# Altium project Bachelor_MCU_Prototype_v1.0.PrjPcb
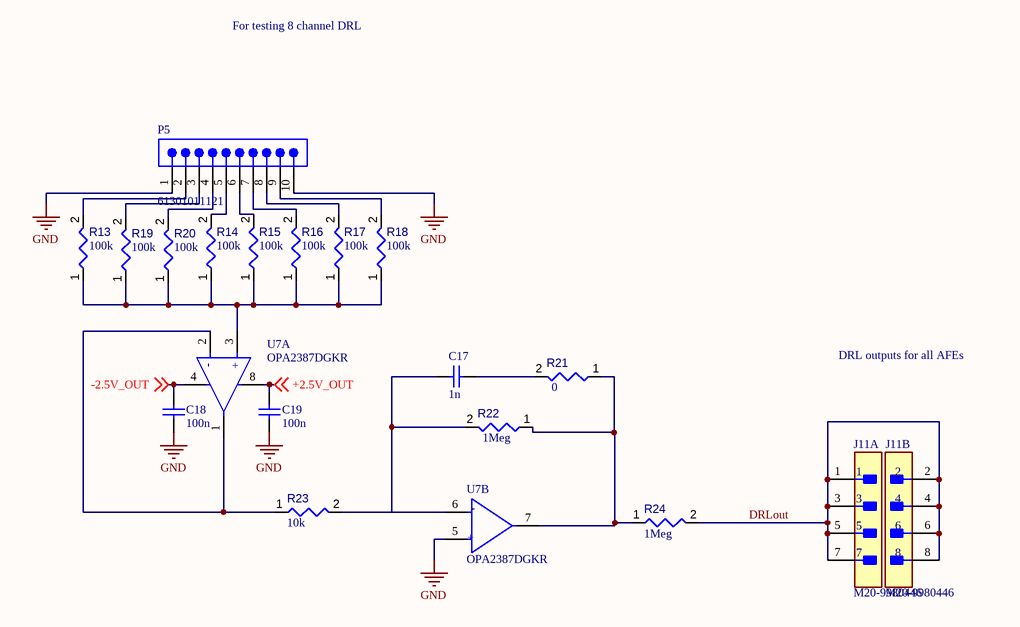
[diagram p0: MCU_8ch_DRL.SchDoc]
1 sheet, 18 parts. Net scope: global (net labels, ports and power ports of the same name join across sheets).
Board file: MCU.PcbDoc

## Sheet MCU_8ch_DRL.SchDoc
size A4; SheetNumber: 4; SheetTotal: 4

### Parts
C17  1n  [WCAP-CSGP_0402_L1W0.5H0.5]
C18  100n  [WCAP-CSGP_0402_L1W0.5H0.5]
C19  100n  [WCAP-CSGP_0402_L1W0.5H0.5]
J11  M20-9980446  [FP-M20-9980446-MFG]  (parts A,B of 2)
P5  61301011121  [61301011121]
R13  value 100k  [RESC1005X40X25ML05T05]  (hidden comment: Resistor 4k7 +/-1% 0402 63 mW)
R14  value 100k  [RESC1005X40X25ML05T05]  (hidden comment: Resistor 4k7 +/-1% 0402 63 mW)
R15  value 100k  [RESC1005X40X25ML05T05]  (hidden comment: Resistor 4k7 +/-1% 0402 63 mW)
R16  value 100k  [RESC1005X40X25ML05T05]  (hidden comment: Resistor 4k7 +/-1% 0402 63 mW)
R17  value 100k  [RESC1005X40X25ML05T05]  (hidden comment: Resistor 4k7 +/-1% 0402 63 mW)
R18  value 100k  [RESC1005X40X25ML05T05]  (hidden comment: Resistor 4k7 +/-1% 0402 63 mW)
R19  value 100k  [RESC1005X40X25ML05T05]  (hidden comment: Resistor 4k7 +/-1% 0402 63 mW)
R20  value 100k  [RESC1005X40X25ML05T05]  (hidden comment: Resistor 4k7 +/-1% 0402 63 mW)
R21  value 0  [RESC1005X40X25ML05T05]  (hidden comment: Resistor 4k7 +/-1% 0402 63 mW)
R22  value 1Meg  [RESC1005X40X25ML05T05]  (hidden comment: Resistor 4k7 +/-1% 0402 63 mW)
R23  value 10k  [RESC1005X40X25ML05T05]  (hidden comment: Resistor 4k7 +/-1% 0402 63 mW)
R24  value 1Meg  [RESC1005X40X25ML05T05]  (hidden comment: Resistor 4k7 +/-1% 0402 63 mW)
U7  OPA2387DGKR  [FP-DGK0008A-IPC_B]  (parts A,B of 2)

### Nets
GND: C18.1 C19.1 P5.1 P5.10 U7.5(+IN_B)
+2.5V_OUT: C19.2 U7.8(V+) ; off-sheet +2.5V_OUT
-2.5V_OUT: C18.2 U7.4(V-) ; off-sheet -2.5V_OUT
DRLout: J11.1 J11.2 J11.3 J11.4 J11.5 J11.6 J11.7 J11.8 R24.2
NetC17_1: C17.1 R21.2
NetC17_2: C17.2 R22.2 R23.2 U7.6(-IN_B)
NetP5_2: P5.2 R13.2
NetP5_3: P5.3 R19.2
NetP5_4: P5.4 R20.2
NetP5_5: P5.5 R14.2
NetP5_6: P5.6 R15.2
NetP5_7: P5.7 R16.2
NetP5_8: P5.8 R17.2
NetP5_9: P5.9 R18.2
NetR13_1: R13.1 R14.1 R15.1 R16.1 R17.1 R18.1 R19.1 R20.1 U7.3(+IN_A)
NetR21_1: R21.1 R22.1 R24.1 U7.7(OUT_B)
NetR23_1: R23.1 U7.1(OUT_A) U7.2(-IN_A)

### Notes on the sheet
- For testing 8 channel DRL
- DRL outputs for all AFEs
- (in symbol CMP-04895-000402-1, part A) -; +
- (in symbol CMP-04895-000402-1, part B) -; +

### Library data of the parts
C17-C19 = CMP-207839-000017-2: CAP CER 10000PF 50V X7R 0402; NexarPartId: 53703204; Insulation Resistance: 10GΩ; Material: Ceramic; Tolerance: 10%; Capacitance: 10nF; Packaging: Tape & Reel (TR); Voltage Rating: 50V; Thickness: 558.8µm; Case Code (Imperial): 0402; Dielectric: X7R; Mount: Surface Mount; Width: 500µm; Height: 500µm; Min Operating Temperature: -55°C; Case/Package: 0402; RoHS: Compliant; Case Code (Metric): 1005; REACH SVHC: Unknown; Max Operating Temperature: 125°C; Voltage Rating (DC): 50V; Length: 1mm
J11 = CMP-15831-000088-1: CONN HEADER VERT 8POS 2.54MM; Row Spacing: 0.1inch; Current Rating: 3A; Mated Stacking Heights: 16.54mm; Insulation Resistance: 10GR; Connector Type: Male Pin; Gender: Male; Number of Contacts: 8; Contact Resistance: 30mR; Contact Material: Brass; Series: M20; Max Operating Temperature: 105°C; REACH SVHC: No SVHC; Flammability Rating: UL94 V-0; Number of Rows: 2; Mount: Through Hole; Contact Plating: Tin; Min Operating Temperature: -40°C; Packaging: Bulk; Radiation Hardening: No; Insulation Material: Nylon; Orientation: Straight; Contact Shape: Square; Max Current Rating: 3A; Contact Type: Male Pin; Depth: 5.08mm; Color: Black; Contact Finish - Mating: TIN; Length: 10.16mm; Housing Color: Black; Package Quantity: 1000; Pitch: 2.54mm; Contact Mating Length: 0.24inch; Termination: Solder; Housing Material: Nylon; Fastening Type: Pull; Insulation Color: Black; Number of Positions: 8; RoHS Compliant: Yes
P5 = CMP-1502-01082-5: NexarPartId: 18818159; Gender: Male; Number of Positions: 10; Operating Supply Voltage: 250V; Current Rating: 3A; Contact Resistance: 20mΩ; Connector Type: Male Pin; Insulation Resistance: 1GΩ; Pitch: 2.54mm; Color: Black; Contact Gender: Male; Height: 8.74mm; Orientation: Vertical; RoHS: Compliant; Packaging: Bulk; Min Operating Temperature: -40°C; Number of Pins: 10; Max Operating Temperature: 105°C; REACH SVHC: Unknown; Voltage Rating: 250V; Number of Rows: 1; Housing Material: PBT; Number of Contacts: 10; Mount: Through Hole; Contact Mating Length: 5.9944mm; Length: 2.54mm; Lead Pitch: 2.54mm; Flammability Rating: UL94 V-0; Termination: Solder; Contact Material: Copper; Width: 25.4mm; Contact Plating: Gold
R13-R24 = CMP-009-00034-5: Chip Resistor, 4.7 KOhm, +/- 1%, 63 mW, -55 to 155 degC, 0402 (1005 Metric); Power: 63mW; Voltage Rating: 50V; Case/Package: 0402; Tolerance: 1%; Max Operating Temperature: 155°C; Pins: 2; RoHS Compliant: True; Min Operating Temperature: -55°C; Mounting Technology: SM
U7 = CMP-04895-000402-1: ULTRA-HIGH PRECISION, ZERO-DRIFT